# EAGLE design SmartDana (EAGLE 9.0.0)
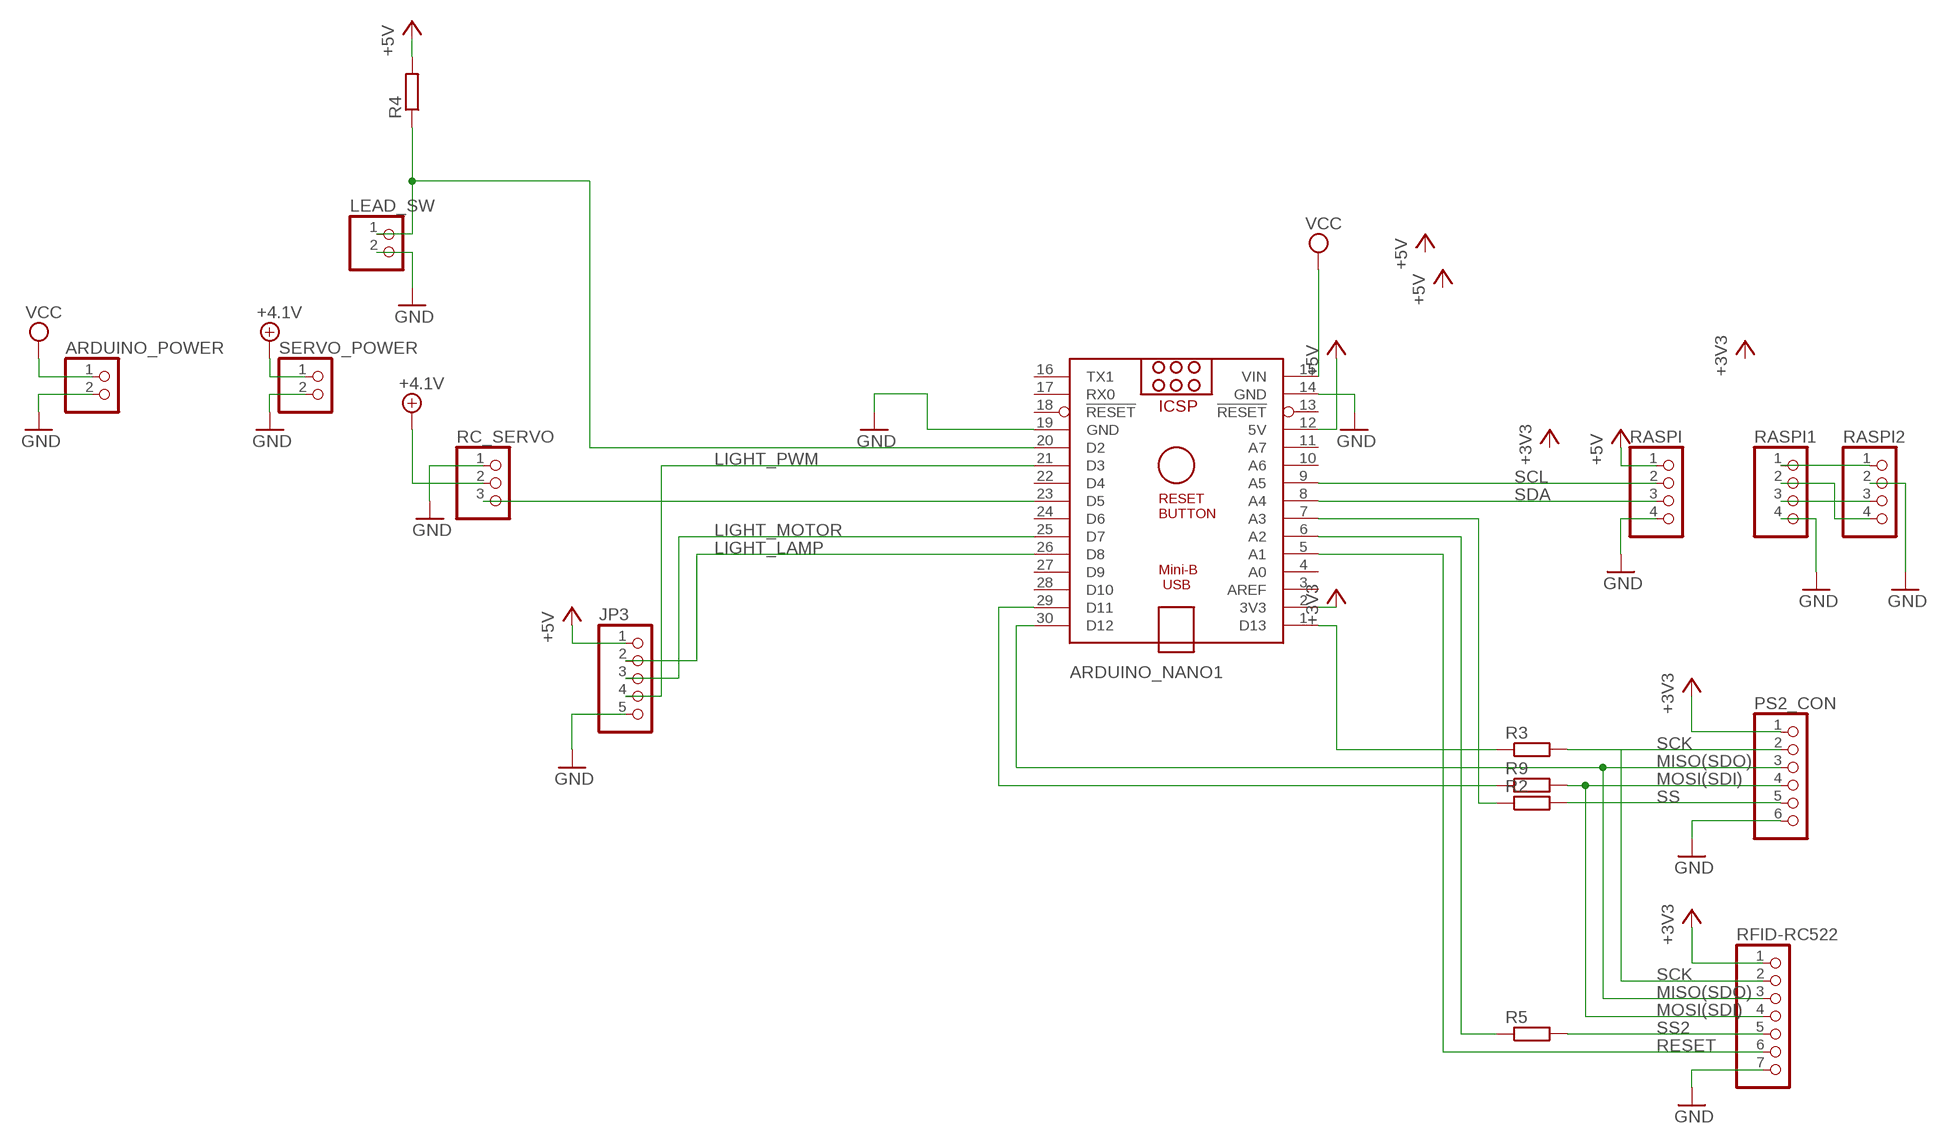
[diagram p0: schematic, sheet 1]

## Parts
ARDUINO_NANO1  ARDUINO_NANO  [ARDUINO_NANO]
ARDUINO_POWER  PINHD-1X2  [1X02]
JP3  PINHD-1X5  [1X05]
LEAD_SW  PINHD-1X2  [1X02]
PS2_CON  PINHD-1X6  [1X06]
R2  R-EU_0204/7  [0204/7]
R3  R-EU_0204/7  [0204/7]
R4  R-EU_0204/7  [0204/7]
R5  R-EU_0204/7  [0204/7]
R9  R-EU_0204/7  [0204/7]
RASPI  PINHD-1X4  [1X04]
RASPI1  PINHD-1X4  [1X04]
RASPI2  PINHD-1X4  [1X04]
RC_SERVO  PINHD-1X3  [1X03]
RFID-RC522  PINHD-1X7  [1X07]
SERVO_POWER  PINHD-1X2  [1X02]

## Nets
+3V3: ARDUINO_NANO1.2(3V3) PS2_CON.1 RFID-RC522.1
+4.1V: RC_SERVO.2 SERVO_POWER.1
+5V: ARDUINO_NANO1.12(5V) JP3.1 R4.2 RASPI.1
GND: ARDUINO_NANO1.14(GND) ARDUINO_NANO1.19(GND) ARDUINO_POWER.2 JP3.5 LEAD_SW.2 PS2_CON.6 RASPI1.4 RASPI2.2 RASPI.4 RC_SERVO.1 RFID-RC522.7 SERVO_POWER.2
LIGHT_LAMP: ARDUINO_NANO1.26(D8) JP3.2
LIGHT_MOTOR: ARDUINO_NANO1.25(D7) JP3.3
LIGHT_PWM: ARDUINO_NANO1.21(D3) JP3.4
MISO(SDO): ARDUINO_NANO1.30(D12) PS2_CON.3 RFID-RC522.3
MOSI(SDI): PS2_CON.4 R9.2 RFID-RC522.4
N$1: ARDUINO_NANO1.29(D11) R9.1
N$2: ARDUINO_NANO1.20(D2) LEAD_SW.1 R4.1
N$3: RASPI1.1 RASPI2.1
N$5: ARDUINO_NANO1.1(D13) R3.1
N$6: ARDUINO_NANO1.7(A3) R2.1
N$7: ARDUINO_NANO1.6(A2) R5.1
N$8: RASPI1.2 RASPI2.4
N$9: RASPI1.3 RASPI2.3
N$12: ARDUINO_NANO1.23(D5) RC_SERVO.3
RESET: ARDUINO_NANO1.5(A1) RFID-RC522.6
SCK: PS2_CON.2 R3.2 RFID-RC522.2
SCL: ARDUINO_NANO1.9(A5) RASPI.2
SDA: ARDUINO_NANO1.8(A4) RASPI.3
SS: PS2_CON.5 R2.2
SS2: R5.2 RFID-RC522.5
VCC: ARDUINO_NANO1.15(VIN) ARDUINO_POWER.1
Unconnected: ARDUINO_NANO1.3(AREF) ARDUINO_NANO1.4(A0) ARDUINO_NANO1.10(A6) ARDUINO_NANO1.11(A7) ARDUINO_NANO1.13(!RESET) ARDUINO_NANO1.16(TX1) ARDUINO_NANO1.17(RX0) ARDUINO_NANO1.18(!RESET) ARDUINO_NANO1.22(D4) ARDUINO_NANO1.24(D6) ARDUINO_NANO1.27(D9) ARDUINO_NANO1.28(D10)

## Library data of the parts
ARDUINO_NANO1 = ArduinoNanoV30:ARDUINO_NANO: Arduino Nano V3.0 Overview: The Arduino Nano is a small, complete, and breadboard-friendly board based on the ATmega328 (Arduino Nano 3.x) or ATmega168 (Arduino Nano 2.x). It has more or less the same functionality of the Arduino Duemilanove, but in a different package. It lacks only a DC power jack, and works with a Mini-B USB cable instead of a standard one. The Nano was designed and is being produced by Gravitech. Specifications: Microcontroller Atmel ATmega168 or ATmega328 Operating Voltage (logic level) 5 V Input Voltage (recommended) 7-12 V Input Voltage (limits) 6-20 V Digital I/O Pins 14 (of which 6 provide PWM output) Analog Input Pins 8 DC Current per I/O Pin 40 mA Flash Memory 16 KB (ATmega168) or 32 KB (ATmega328) of which 2 KB used by bootloader SRAM 1 KB (ATmega168) or 2 KB (ATmega328) EEPROM 512 bytes (ATmega168) or 1 KB (ATmega328) Clock Speed 16 MHz Dimensions 0.73" x 1.70" Length 45 mm Width 18 mm Weigth 5 g Power: The Arduino Nano can be powered via the Mini-B USB connection, 6-20V unregulated external power supply (pin 30), or 5V regulated external power supply (pin 27). The power source is automatically selected to the highest voltage source. Memory: The ATmega168 has 16 KB of flash memory for storing code (of which 2 KB is used for the bootloader); the ATmega328 has 32 KB, (also with 2 KB used for the bootloader). The ATmega168 has 1 KB of SRAM and 512 bytes of EEPROM (which can be read and written with the EEPROM library); the ATmega328 has 2 KB of SRAM and 1 KB of EEPROM. Input and Output: Each of the 14 digital pins on the Nano can be used as an input or output, using pinMode(), digitalWrite(), and digitalRead() functions. They operate at 5 volts. Each pin can provide or receive a maximum of 40 mA and has an internal pull-up resistor (disconnected by default) of 20-50 kOhms. In addition, some pins have specialized functions. Visit Arduino - ArduinoBoardNano <https://www.arduino.cc/en/Main/ArduinoBoardNano>
ARDUINO_POWER LEAD_SW SERVO_POWER = pinhead:PINHD-1X2: PIN HEADER
JP3 = pinhead:PINHD-1X5: PIN HEADER
PS2_CON = pinhead:PINHD-1X6: PIN HEADER
R2-R5 R9 = rcl:R-EU_: RESISTOR, European symbol; SPICEPREFIX: R
RASPI RASPI1 RASPI2 = pinhead:PINHD-1X4: PIN HEADER
RC_SERVO = pinhead:PINHD-1X3: PIN HEADER
RFID-RC522 = pinhead:PINHD-1X7: PIN HEADER

## Board
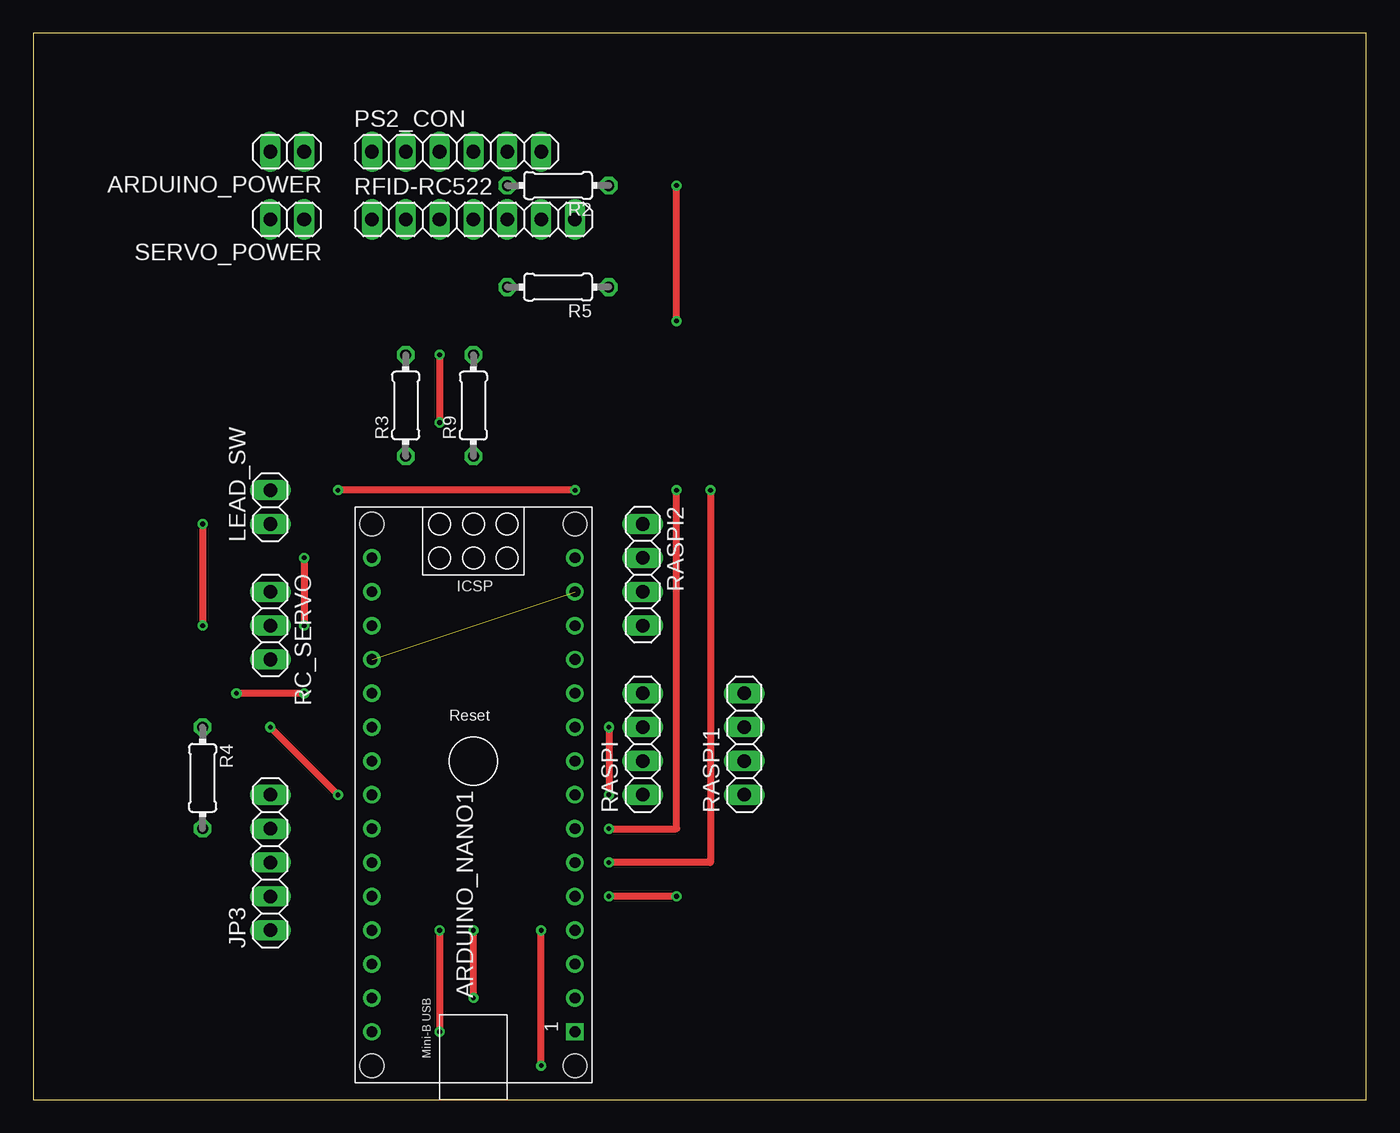
[diagram p1: board, top side]
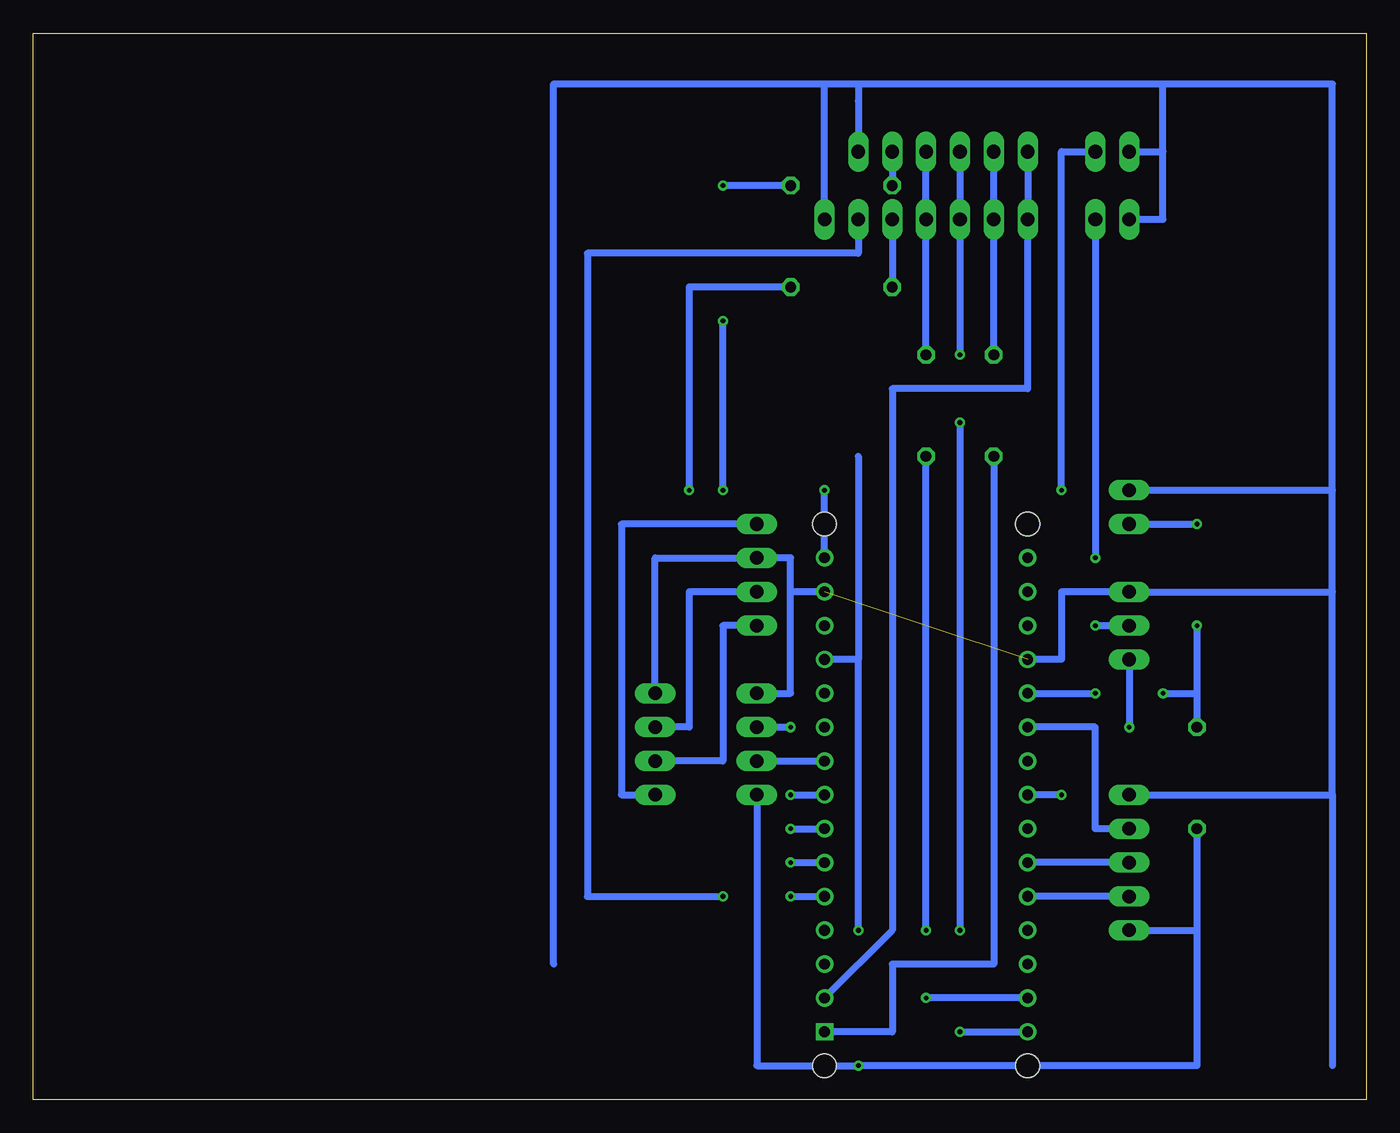
[diagram p2: board, bottom side, seen from below]

Size 100 x 80 mm. Coordinates in mm from the lower left corner, seen from the top.
Outline: 0,0 100,0 100,80 0,80 0,0
Copper layers (1*16): Top 0.035mm / dielectric 1.5mm / Bottom 0.035mm
Design rules "default": minimum track width 6mil, minimum drill 0.35mm, track to track 6mil, track to pad 6mil, pad to pad 6mil, via to via 6mil, smd to smd 6mil, copper to edge 40mil, drill to drill 6mil, minimum pad ring 10mil, minimum via ring 8mil, stop-mask expansion 4mil, vias tented up to drill 0mil, thermal gap 10mil

### Footprints (pad centres in the part's own frame; a part is rotated, then mirrored left to right if it is on the bottom)
ARDUINO_NANO = drill 0.8 square: 1 -20.32,-7.62 | drill 0.8: 2 -17.78,-7.62; 3 -15.24,-7.62; 4 -12.7,-7.62; 5 -10.16,-7.62; 6 -7.62,-7.62; 7 -5.08,-7.62; 8 -2.54,-7.62; 9 0,-7.62; 10 2.54,-7.62; 11 5.08,-7.62; 12 7.62,-7.62; 13 10.16,-7.62; 14 12.7,-7.62; 15 15.24,-7.62; 16 15.24,7.62; 17 12.7,7.62; 18 10.16,7.62; 19 7.62,7.62; 20 5.08,7.62; 21 2.54,7.62; 22 0,7.62; 23 -2.54,7.62; 24 -5.08,7.62; 25 -7.62,7.62; 26 -10.16,7.62; 27 -12.7,7.62; 28 -15.24,7.62; 29 -17.78,7.62; 30 -20.32,7.62 | hole 1.778: -22.86,-7.62; -22.86,7.62; 17.78,7.62; 17.78,-7.62
1X02 = drill 1.016 long: 1 -1.27,0; 2 1.27,0
1X05 = drill 1.016 long: 1 -5.08,0; 2 -2.54,0; 3 0,0; 4 2.54,0; 5 5.08,0
1X06 = drill 1.016 long: 1 -6.35,0; 2 -3.81,0; 3 -1.27,0; 4 1.27,0; 5 3.81,0; 6 6.35,0
0204/7 = drill 0.813 octagon: 1 -3.81,0; 2 3.81,0
1X04 = drill 1.016 long: 1 -3.81,0; 2 -1.27,0; 3 1.27,0; 4 3.81,0
1X03 = drill 1.016 long: 1 -2.54,0; 2 0,0; 3 2.54,0
1X07 = drill 1.016 long: 1 -7.62,0; 2 -5.08,0; 3 -2.54,0; 4 0,0; 5 2.54,0; 6 5.08,0; 7 7.62,0

### Placement (x,y rotation side)
ARDUINO_NANO1  33.02,25.4 90 top
ARDUINO_POWER  19.05,71.12 180 top
JP3  17.78,17.78 90 top
LEAD_SW  17.78,44.45 90 top
PS2_CON  31.75,71.12 0 top
R2  39.37,68.58 180 top
R3  27.94,52.07 90 top
R4  12.7,24.13 270 top
R5  39.37,60.96 180 top
R9  33.02,52.07 90 top
RASPI  45.72,26.67 90 top
RASPI1  53.34,26.67 90 top
RASPI2  45.72,39.37 270 top
RC_SERVO  17.78,35.56 270 top
RFID-RC522  33.02,66.04 0 top
SERVO_POWER  19.05,66.04 180 top

### Tracks (layer width: path | path; a pad name or v marks a point on that pad's centre or on a via)
+3V3
  Bottom 0.508: PS2_CON.1 RFID-RC522.1 25.4,53.34 35.56,53.34 35.56,12.7 ARDUINO_NANO1.2
+4.1V  (via drill 0.35)
  Top 0.508: v20.32,40.64 v20.32,35.56
  Bottom 0.508: SERVO_POWER.1 v20.32,40.64 | v20.32,35.56 RC_SERVO.2
+5V  (via drill 0.35)
  Top 0.508: v38.1,2.54 v38.1,12.7
  Bottom 0.508: v38.1,12.7 38.1,33.02 | R4.2 12.7,12.7 | 12.7,12.7 12.7,2.54 v38.1,2.54 45.72,2.54 RASPI.1 | JP3.1 12.7,12.7 | 38.1,48.26 38.1,33.02 | 38.1,33.02 ARDUINO_NANO1.12
  other vias: 17.78,12.7
GND  (1 unrouted)
  Bottom 0.508: 60.96,10.16 60.96,76.2 40.64,76.2 | 2.54,22.86 2.54,2.54 | 40.64,76.2 38.1,76.2 | 38.1,76.2 15.24,76.2 | 15.24,76.2 2.54,76.2 2.54,45.72 | 38.1,76.2 PS2_CON.6 38.1,74.93 | JP3.5 2.54,22.86 | 2.54,22.86 2.54,38.1 | 2.54,38.1 2.54,45.72 | LEAD_SW.2 2.54,45.72 | 2.54,38.1 RC_SERVO.1 22.86,38.1 22.86,33.02 ARDUINO_NANO1.19 | RASPI.4 43.18,30.48 43.18,38.1 | 43.18,38.1 43.18,40.64 RASPI2.2 53.34,40.64 RASPI1.4 | ARDUINO_NANO1.14 43.18,38.1 | ARDUINO_POWER.2 15.24,71.12 | 15.24,71.12 15.24,76.2 | SERVO_POWER.2 15.24,66.04 15.24,71.12 | RFID-RC522.7 40.64,76.2
LIGHT_LAMP
  Bottom 0.508: JP3.2 ARDUINO_NANO1.26
LIGHT_MOTOR
  Bottom 0.508: JP3.3 ARDUINO_NANO1.25
LIGHT_PWM
  Bottom 0.508: ARDUINO_NANO1.21 20.32,27.94 20.32,20.32 JP3.4
MISO(SDO)  (via drill 0.35)
  Top 0.508: v30.48,12.7 v30.48,5.08 | v30.48,55.88 v30.48,50.8
  Bottom 0.508: PS2_CON.3 RFID-RC522.3 v30.48,55.88 | v30.48,5.08 ARDUINO_NANO1.30 | v30.48,50.8 v30.48,12.7
MOSI(SDI)
  Bottom 0.508: PS2_CON.4 RFID-RC522.4 R9.2
N$1  (via drill 0.35)
  Top 0.508: v33.02,7.62 v33.02,12.7
  Bottom 0.508: ARDUINO_NANO1.29 v33.02,7.62 | v33.02,12.7 R9.1
N$2  (via drill 0.35)
  Top 0.508: v20.32,30.48 v15.24,30.48 | v12.7,43.18 v12.7,35.56
  Bottom 0.508: 12.7,30.48 R4.1 | ARDUINO_NANO1.20 v20.32,30.48 | v15.24,30.48 12.7,30.48 | LEAD_SW.1 v12.7,43.18 | v12.7,35.56 12.7,30.48
N$3
  Bottom 0.508: RASPI2.1 55.88,43.18 55.88,22.86 RASPI1.1
N$5
  Bottom 0.508: R3.1 27.94,10.16 35.56,10.16 35.56,5.08 ARDUINO_NANO1.1
N$6  (via drill 0.35)
  Top 0.508: v43.18,20.32 48.26,20.32 v48.26,45.72 | v48.26,58.42 v48.26,68.58
  Bottom 0.508: R2.1 v48.26,68.58 | v43.18,20.32 ARDUINO_NANO1.7 | v48.26,45.72 v48.26,58.42
N$7  (via drill 0.35)
  Top 0.508: v50.8,45.72 50.8,17.78 v43.18,17.78
  Bottom 0.508: v43.18,17.78 ARDUINO_NANO1.6 | R5.1 50.8,60.96 v50.8,45.72
N$8
  Bottom 0.508: RASPI2.4 48.26,35.56 48.26,25.4 RASPI1.2
N$9
  Bottom 0.508: RASPI2.3 50.8,38.1 50.8,27.94 RASPI1.3
N$12  (via drill 0.35)
  Top 0.508: v17.78,27.94 v22.86,22.86
  Bottom 0.508: v22.86,22.86 ARDUINO_NANO1.23 | RC_SERVO.3 v17.78,27.94
RESET  (via drill 0.35)
  Top 0.508: v48.26,15.24 v43.18,15.24
  Bottom 0.508: RFID-RC522.6 38.1,63.5 58.42,63.5 58.42,15.24 v48.26,15.24 | v43.18,15.24 ARDUINO_NANO1.5
SCK
  Bottom 0.508: PS2_CON.2 RFID-RC522.2 R3.2
SCL
  Bottom 0.508: RASPI.2 ARDUINO_NANO1.9
SDA  (via drill 0.35)
  Top 0.508: v43.18,27.94 v43.18,22.86
  Bottom 0.508: RASPI.3 v43.18,27.94 | v43.18,22.86 ARDUINO_NANO1.8
SS
  Bottom 0.508: PS2_CON.5 R2.2
SS2
  Bottom 0.508: RFID-RC522.5 R5.2
VCC  (via drill 0.35)
  Top 0.508: v40.64,45.72 v22.86,45.72
  Bottom 0.508: ARDUINO_NANO1.15 v40.64,45.72 | v22.86,45.72 22.86,71.12 ARDUINO_POWER.1